# Altium schematic sheet EPS_SCH.SchDoc
size A
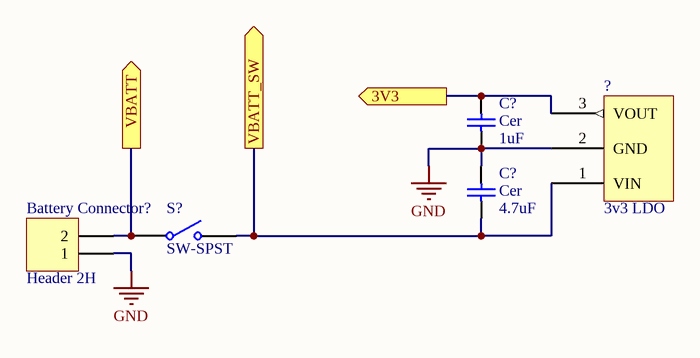
[diagram p0: EPS_SCH.SchDoc]

## Parts
(Parts that share a designator on the sheet are numbered #1, #2 ... from top to bottom, then left to right.)
?  3v3 LDO
Battery_Connector?  Header 2H  [HDR1X2H]
C?#1  Cer  value 1uF  [RAD-0.3]
C?#2  Cer  value 4.7uF  [RAD-0.3]
S?  SW-SPST  [SPST-2]

## Ports
3V3 (out), VBATT (out), VBATT_SW (out)

## Nets
GND: ?.2(GND) Battery_Connector?.1 C?#1.1 C?#2.2
3V3: ?.3(VOUT) C?#1.2 ; port 3V3
VBATT: Battery_Connector?.2 S?.1(COMMON) ; port VBATT
VBATT_SW: ?.1(VIN) C?#2.1 S?.2(NO) ; port VBATT_SW

## Library data of the parts
? = 3v3 LDO: MCP1826S-3302E/AB
Battery_Connector? = Header 2H: Header, 2-Pin, Right Angle; LatestRevisionDate: 17-Jul-2002; LatestRevisionNote: Re-released for DXP Platform.; Publisher: Altium Limited
C?#1 C?#2 = Cap: Capacitor; Published: 8-Jun-2000; LatestRevisionDate: 17-Jul-2002; LatestRevisionNote: Re-released for DXP Platform.; PackageReference: RAD-0.3; Publisher: Altium Limited; PackageDescription: Radial Cap, Thru-Hole; 2 Leads; 0.3 in Pin Spacing
S? = SW-SPST: Single-Pole, Single-Throw Switch; Published: 24-Mar-1999; LatestRevisionDate: 17-Jul-2002; LatestRevisionNote: Re-released for DXP Platform.; PackageReference: SPST-2; Publisher: Altium Limited; PackageDescription: Switch; 2 Leads